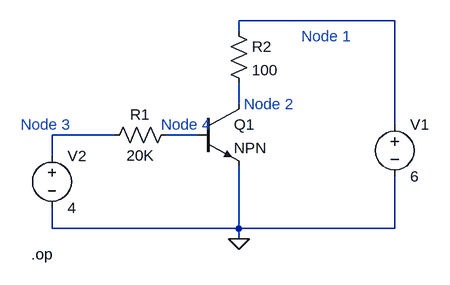
[diagram p0: schematic test_circuit_3a.asc]
test_circuit_3a.asc, the LTspice schematic file:
Version 4
SHEET 1 880 680
WIRE 448 -80 208 -80
WIRE 208 -64 208 -80
WIRE 208 48 208 16
WIRE 448 80 448 -80
WIRE 16 96 -80 96
WIRE 144 96 96 96
WIRE -80 128 -80 96
WIRE -80 240 -80 208
WIRE 208 240 208 144
WIRE 208 240 -80 240
WIRE 448 240 448 160
WIRE 448 240 208 240
WIRE 208 256 208 240
FLAG 208 256 0
SYMBOL voltage 448 64 R0
WINDOW 123 0 0 Left 0
WINDOW 39 0 0 Left 0
SYMATTR InstName V1
SYMATTR Value 6
SYMBOL voltage -80 112 R0
WINDOW 123 0 0 Left 0
WINDOW 39 0 0 Left 0
SYMATTR InstName V2
SYMATTR Value 4
SYMBOL res 112 80 R90
WINDOW 0 0 56 VBottom 2
WINDOW 3 32 56 VTop 2
SYMATTR InstName R1
SYMATTR Value 20K
SYMBOL res 192 -80 R0
SYMATTR InstName R2
SYMATTR Value 100
SYMBOL npn 144 48 R0
SYMATTR InstName Q1
TEXT -112 280 Left 2 !.op
TEXT 304 -56 Left 2 ;Node 1
TEXT -128 80 Left 2 ;Node 3
TEXT 88 80 Left 2 ;Node 4
TEXT 216 48 Left 2 ;Node 2

The netlist it stands for:
* test_circuit_3a.asc
V1 N001 0 6
V2 N003 0 4
R1 N004 N003 20K
R2 N001 N002 100
Q1 N002 N004 0 0 NPN
.model NPN NPN
.model PNP PNP
.lib standard.bjt
.op
* Node 1
* Node 3
* Node 4
* Node 2
.backanno
.end